# Altium schematic sheet Microcontroller Stage.SchDoc: Microcontroller Stage
size A3; Date: 28.04.2010; ApprovedBy: V.Gyurov; CheckedBy: V.Gyurov; Author: V.Gyurov; CompanyName: V.Gyurov; DrawnBy: V.Gyurov; Engineer: V.Gyurov; Organization: none; DocumentNumber: 5; Revision: 00; SheetNumber: 5; SheetTotal: 7; VersionControl_RevNumber: V1.00 R.00; IsUserConfigurable: none; CurrentDate: 28.04.2010; DocumentName: Microcontroller Stage; ModifiedDate: 28.04.2010
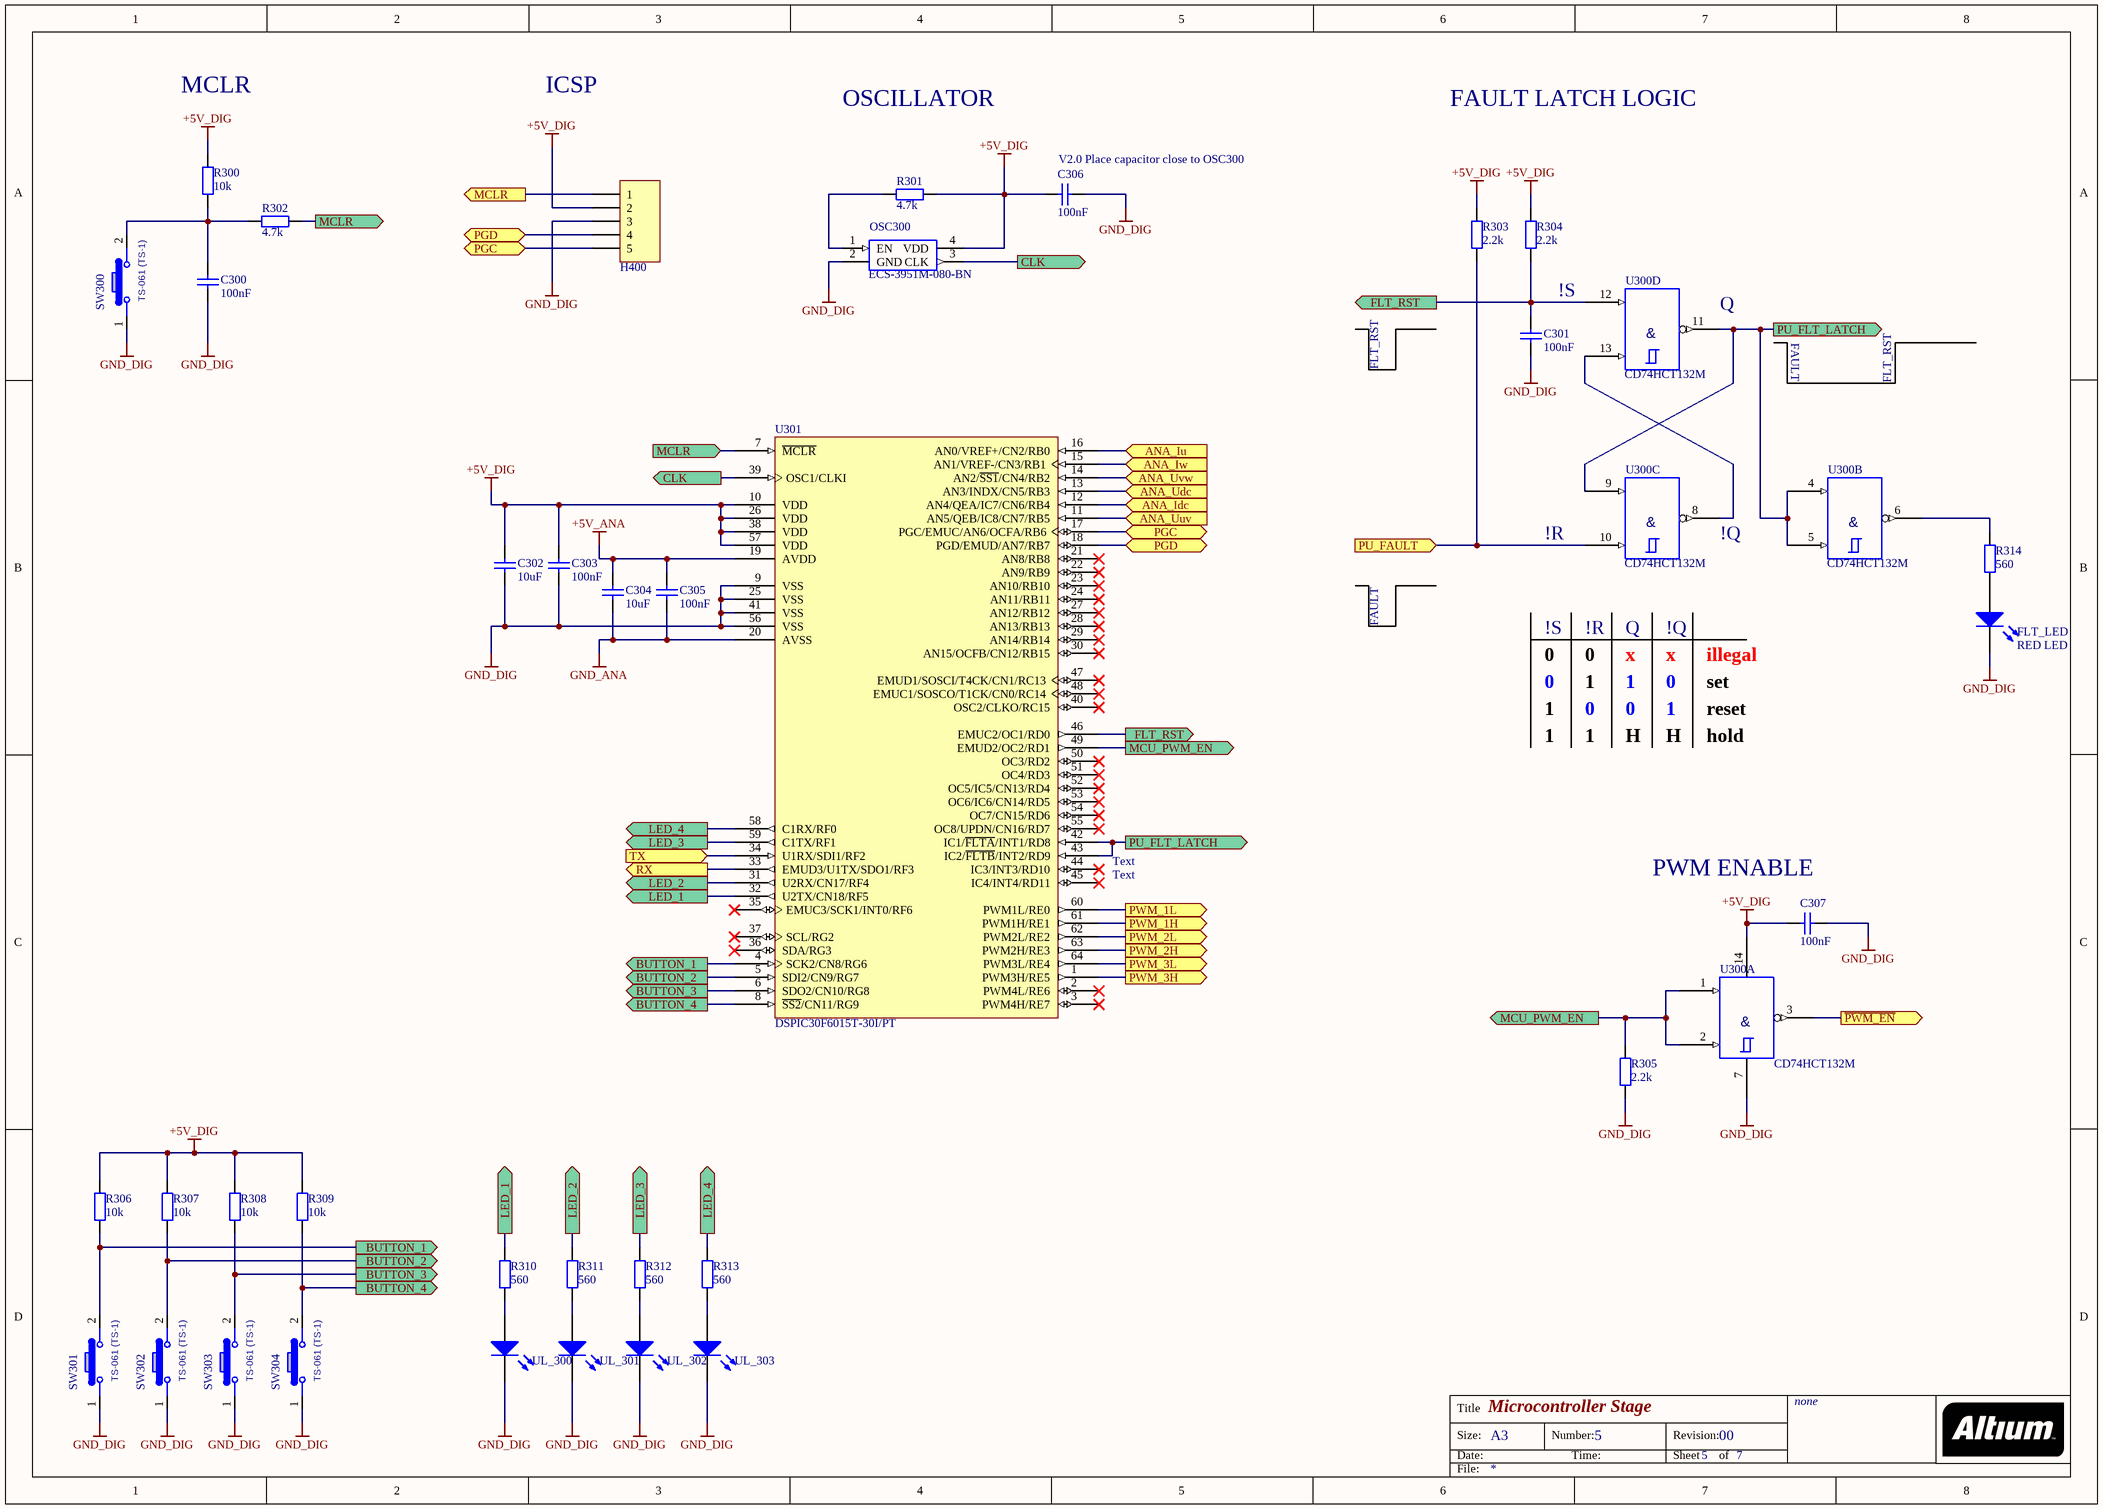
[diagram p0: Microcontroller Stage.SchDoc]

## Parts
C300  value 100nF  [1206_REFLOW]  (hidden comment: Cap 1206)
C301  value 100nF  [1206_REFLOW]  (hidden comment: Cap 1206)
C302  value 10uF  [1206_REFLOW]  (hidden comment: Cap 1206)
C303  value 100nF  [1206_REFLOW]  (hidden comment: Cap 1206)
C304  value 10uF  [1206_REFLOW]  (hidden comment: Cap 1206)
C305  value 100nF  [1206_REFLOW]  (hidden comment: Cap 1206)
C306  value 100nF  [1206_REFLOW]  (hidden comment: Cap 1206)
C307  value 100nF  [1206_REFLOW]  (hidden comment: Cap 1206)
FLT_LED  RED LED  [LED_1206]
H400  HEADER X5  [SIP5]  (value not drawn)
OSC300  value ECS-3951M-080-BN  [OSC7X5]  (hidden comment: ESC-3951M-80-BN)
R300  value 10k  [1206_REFLOW]  (hidden comment: RES)
R301  value 4.7k  [1206_REFLOW]  (hidden comment: RES)
R302  value 4.7k  [1206_REFLOW]  (hidden comment: RES)
R303  value 2.2k  [1206_REFLOW]  (hidden comment: RES)
R304  value 2.2k  [1206_REFLOW]  (hidden comment: RES)
R305  value 2.2k  [1206_REFLOW]  (hidden comment: RES)
R306  value 10k  [1206_REFLOW]  (hidden comment: RES)
R307  value 10k  [1206_REFLOW]  (hidden comment: RES)
R308  value 10k  [1206_REFLOW]  (hidden comment: RES)
R309  value 10k  [1206_REFLOW]  (hidden comment: RES)
R310  value 560  [1206_REFLOW]  (hidden comment: RES)
R311  value 560  [1206_REFLOW]  (hidden comment: RES)
R312  value 560  [1206_REFLOW]  (hidden comment: RES)
R313  value 560  [1206_REFLOW]  (hidden comment: RES)
R314  value 560  [1206_REFLOW]  (hidden comment: RES)
SW300  TS-061 (TS-1)  [BUTTON]
SW301  TS-061 (TS-1)  [BUTTON]
SW302  TS-061 (TS-1)  [BUTTON]
SW303  TS-061 (TS-1)  [BUTTON]
SW304  TS-061 (TS-1)  [BUTTON]
U300  CD74HCT132M  [SO14]  (parts A,B,C,D of 4)
U301  DSPIC30F6015T-30I/PT  [TQFP-PT64_N]
UL_300  YELLOW LED  [LED_1206]  (value not drawn)
UL_301  YELLOW LED  [LED_1206]  (value not drawn)
UL_302  YELLOW LED  [LED_1206]  (value not drawn)
UL_303  YELLOW LED  [LED_1206]  (value not drawn)

## Ports
ANA_Idc (in), ANA_Iu (in), ANA_Iw (in), ANA_Udc (in), ANA_Uuv (in), ANA_Uvw (in), BUTTON_1 (out), BUTTON_2 (out), BUTTON_3 (out), BUTTON_4 (out), CLK (out), FLT_RST (out), LED_1 (out), LED_2 (out), LED_3 (out), LED_4 (out), MCLR (in), MCLR (out), MCU_PWM_EN (out), PGC (bidir), PGD (bidir), PU_FAULT (in), PU_FLT_LATCH (out), PWM_1H (out), PWM_1L (out), PWM_2H (out), PWM_2L (out), PWM_3H (out), PWM_3L (out), RX (out), TX (in), ~{PWM_EN} (out)

## Nets
+5V_ANA: C304.2 C305.2 U301.19(AVDD)
+5V_DIG: C302.2 C303.2 C306.1 C307.2 H400.2 OSC300.4(VDD) R300.1 R301.1 R303.1 R304.1 R306.1 R307.1 R308.1 R309.1 U300.14(Vcc) U301.10(VDD) U301.26(VDD) U301.38(VDD) U301.57(VDD)
GND_ANA: C304.1 C305.1 U301.20(AVSS)
GND_DIG: C300.1 C301.1 C302.1 C303.1 C306.2 C307.1 FLT_LED.K H400.3 OSC300.2(GND) R305.2 SW300.1 SW301.1 SW302.1 SW303.1 SW304.1 U300.7(GND) U301.9(VSS) U301.25(VSS) U301.41(VSS) U301.56(VSS) UL_300.K UL_301.K UL_302.K UL_303.K
ANA_Idc: U301.12(AN4/QEA/IC7/CN6/RB4) ; port ANA_Idc
ANA_Iu: U301.16(AN0/VREF+/CN2/RB0) ; port ANA_Iu
ANA_Iw: U301.15(AN1/VREF-/CN3/RB1) ; port ANA_Iw
ANA_Udc: U301.13(AN3/INDX/CN5/RB3) ; port ANA_Udc
ANA_Uuv: U301.11(AN5/QEB/IC8/CN7/RB5) ; port ANA_Uuv
ANA_Uvw: U301.14(AN2/~{SS1}/CN4/RB2) ; port ANA_Uvw
BUTTON_1: R306.2 SW301.2 U301.4(SCK2/CN8/RG6) ; port BUTTON_1
BUTTON_2: R307.2 SW302.2 U301.5(SDI2/CN9/RG7) ; port BUTTON_2
BUTTON_3: R308.2 SW303.2 U301.6(SDO2/CN10/RG8) ; port BUTTON_3
BUTTON_4: R309.2 SW304.2 U301.8(~{SS2}/CN11/RG9) ; port BUTTON_4
CLK: OSC300.3(CLK) U301.39(OSC1/CLKI) ; port CLK
FLT_RST: C301.2 R304.2 U300.12(4A) U301.46(EMUC2/OC1/RD0) ; port FLT_RST
LED_1: R310.2 U301.32(U2TX/CN18/RF5) ; port LED_1
LED_2: R311.2 U301.31(U2RX/CN17/RF4) ; port LED_2
LED_3: R312.2 U301.59(C1TX/RF1) ; port LED_3
LED_4: R313.2 U301.58(C1RX/RF0) ; port LED_4
MCLR: H400.1 R302.2 U301.7(~{MCLR}) ; port MCLR
MCU_PWM_EN: R305.1 U300.1(1A) U300.2(1B) U301.49(EMUD2/OC2/RD1) ; port MCU_PWM_EN
~{PWM_EN}: U300.3(~{1Y}) ; port ~{PWM_EN}
PGC: H400.5 U301.17(PGC/EMUC/AN6/OCFA/RB6) ; port PGC
PGD: H400.4 U301.18(PGD/EMUD/AN7/RB7) ; port PGD
PU_FAULT: R303.2 U300.10(3B) ; port PU_FAULT
PU_FLT_LATCH: U300.4(2A) U300.5(2B) U300.9(3A) U300.11(~{4Y}) U301.42(IC1/~{FLTA}/INT1/RD8) U301.43(IC2/~{FLTB}/INT2/RD9) ; port PU_FLT_LATCH
PWM_1H: U301.61(PWM1H/RE1) ; port PWM_1H
PWM_1L: U301.60(PWM1L/RE0) ; port PWM_1L
PWM_2H: U301.63(PWM2H/RE3) ; port PWM_2H
PWM_2L: U301.62(PWM2L/RE2) ; port PWM_2L
PWM_3H: U301.1(PWM3H/RE5) ; port PWM_3H
PWM_3L: U301.64(PWM3L/RE4) ; port PWM_3L
RX: U301.33(EMUD3/U1TX/SDO1/RF3) ; port RX
TX: U301.34(U1RX/SDI1/RF2) ; port TX
NetC300_2: C300.2 R300.2 R302.1 SW300.2
NetFLT_LED_A: FLT_LED.A R314.1
NetOSC300_1: OSC300.1(EN) R301.2
NetR310_1: R310.1 UL_300.A
NetR311_1: R311.1 UL_301.A
NetR312_1: R312.1 UL_302.A
NetR313_1: R313.1 UL_303.A
NetR314_2: R314.2 U300.6(~{2Y})
NetU300_8: U300.8(~{3Y}) U300.13(4B)

Not connected (* = marked no-connect by the designer): SW300 3 4; SW301 3 4; SW302 3 4; SW303 3 4; SW304 3 4; U301 2(PWM4L/RE6)* 3(PWM4H/RE7)* 21(AN8/RB8)* 22(AN9/RB9)* 23(AN10/RB10)* 24(AN11/RB11)* 27(AN12/RB12)* 28(AN13/RB13)* 29(AN14/RB14)* 30(AN15/OCFB/CN12/RB15)* 35(EMUC3/SCK1/INT0/RF6)* 36(SDA/RG3)* 37(SCL/RG2)* 40(OSC2/CLKO/RC15)* 44(IC3/INT3/RD10)* 45(IC4/INT4/RD11)* 47(EMUD1/SOSCI/T4CK/CN1/RC13)* 48(EMUC1/SOSCO/T1CK/CN0/RC14)* 50(OC3/RD2)* 51(OC4/RD3)* 52(OC5/IC5/CN13/RD4)* 53(OC6/IC6/CN14/RD5)* 54(OC7/CN15/RD6)* 55(OC8/UPDN/CN16/RD7)*

## Notes on the sheet
- MCLR
- ICSP
- OSCILLATOR
- FAULT LATCH LOGIC
- (near C306) V2.0 Place capacitor close to OSC300
- !S
- (near U300) Q
- FLT_RST
- FAULT
- !R
- (near U300) !Q
- Q
- !Q
- 0
- 1
- x
- set
- reset
- illegal
- H
- hold
- Text
- (near C307) PWM ENABLE
- Title
- Size:
- Date:
- A3
- Number:
- Time:
- Revision:
- Sheet
- of
- File:
- (in symbol CD74HCT132M, part A) &
- (in symbol CD74HCT132M, part B) &
- (in symbol CD74HCT132M, part C) &
- (in symbol CD74HCT132M, part D) &

## Library data of the parts
FLT_LED UL_300-UL_303 = LED: Value: TBD
OSC300 = ESC-3951M-80-BN: ESC-3951M-80-BN 8Mhz; Mfrr: ECS Inc; Mfrr Part No.: ECS-3951M-080-BN-TR; Order Code: XC295CT-ND; Group: IC; Subgroup: Oscillator; Supplier: Digi-Key
R300-R314 = RES 1
SW300-SW304 = TS-061 (TS-1): BUTTON; Value: TS-061 (TS-1)
U300 = CD74HCT132M: Manufacturer 1: Texas Instruments; PN: 01010108-0013-0000; Group: Logic ICs; Detail: QUADRUPLE POSITIVE-NAND GATES WITH SCHMITT-TRIGGER INPUTS; Case: SO-14; Mfr 1 PN: CD74HCT132M; Manufacturer 2: *; Mfr 2 PN: *; ModifyDate: 06/06/2008 17:02:07; Value: CD74HCT132M
U301 = DSPIC30F6015T-30I/PT: High-Performance 16-bit Digital Signal Controller, 144 KB Flash, 8 KB SRAM, 4 KB EEPROM, 64-Pin TQFP, Industrial Temperature, Tape and Reel; Published: 29-Jan-2009; DatasheetVersion: revD, Jun-2008; PackageVersion: revAW, Oct-2008; PackageReference: TQFP-PT64; Publisher: Altium Limited; PackageDescription: 64-Lead Thin Plastic Quad Flat Pack (PT) - 10x10x1mm Body, 2.00mm [TQFP]; Code_JEDEC: MS-026; ComponentLink1Description: Manufacturer Link; ComponentLink1URL: http://www.microchip.com; ComponentLink2Description: Datasheet; ComponentLink2URL: http://ww1.microchip.com/downloads/en/DeviceDoc/70150D.pdf; ComponentLink3Description: Packaging Specification; ComponentLink3URL: http://ww1.microchip.com/downloads/en/PackagingSpec/00049AW.pdf
H400 = HEADER X5: Value: HEADER X5